# EAGLE design battery_box2 (EAGLE 6.4)
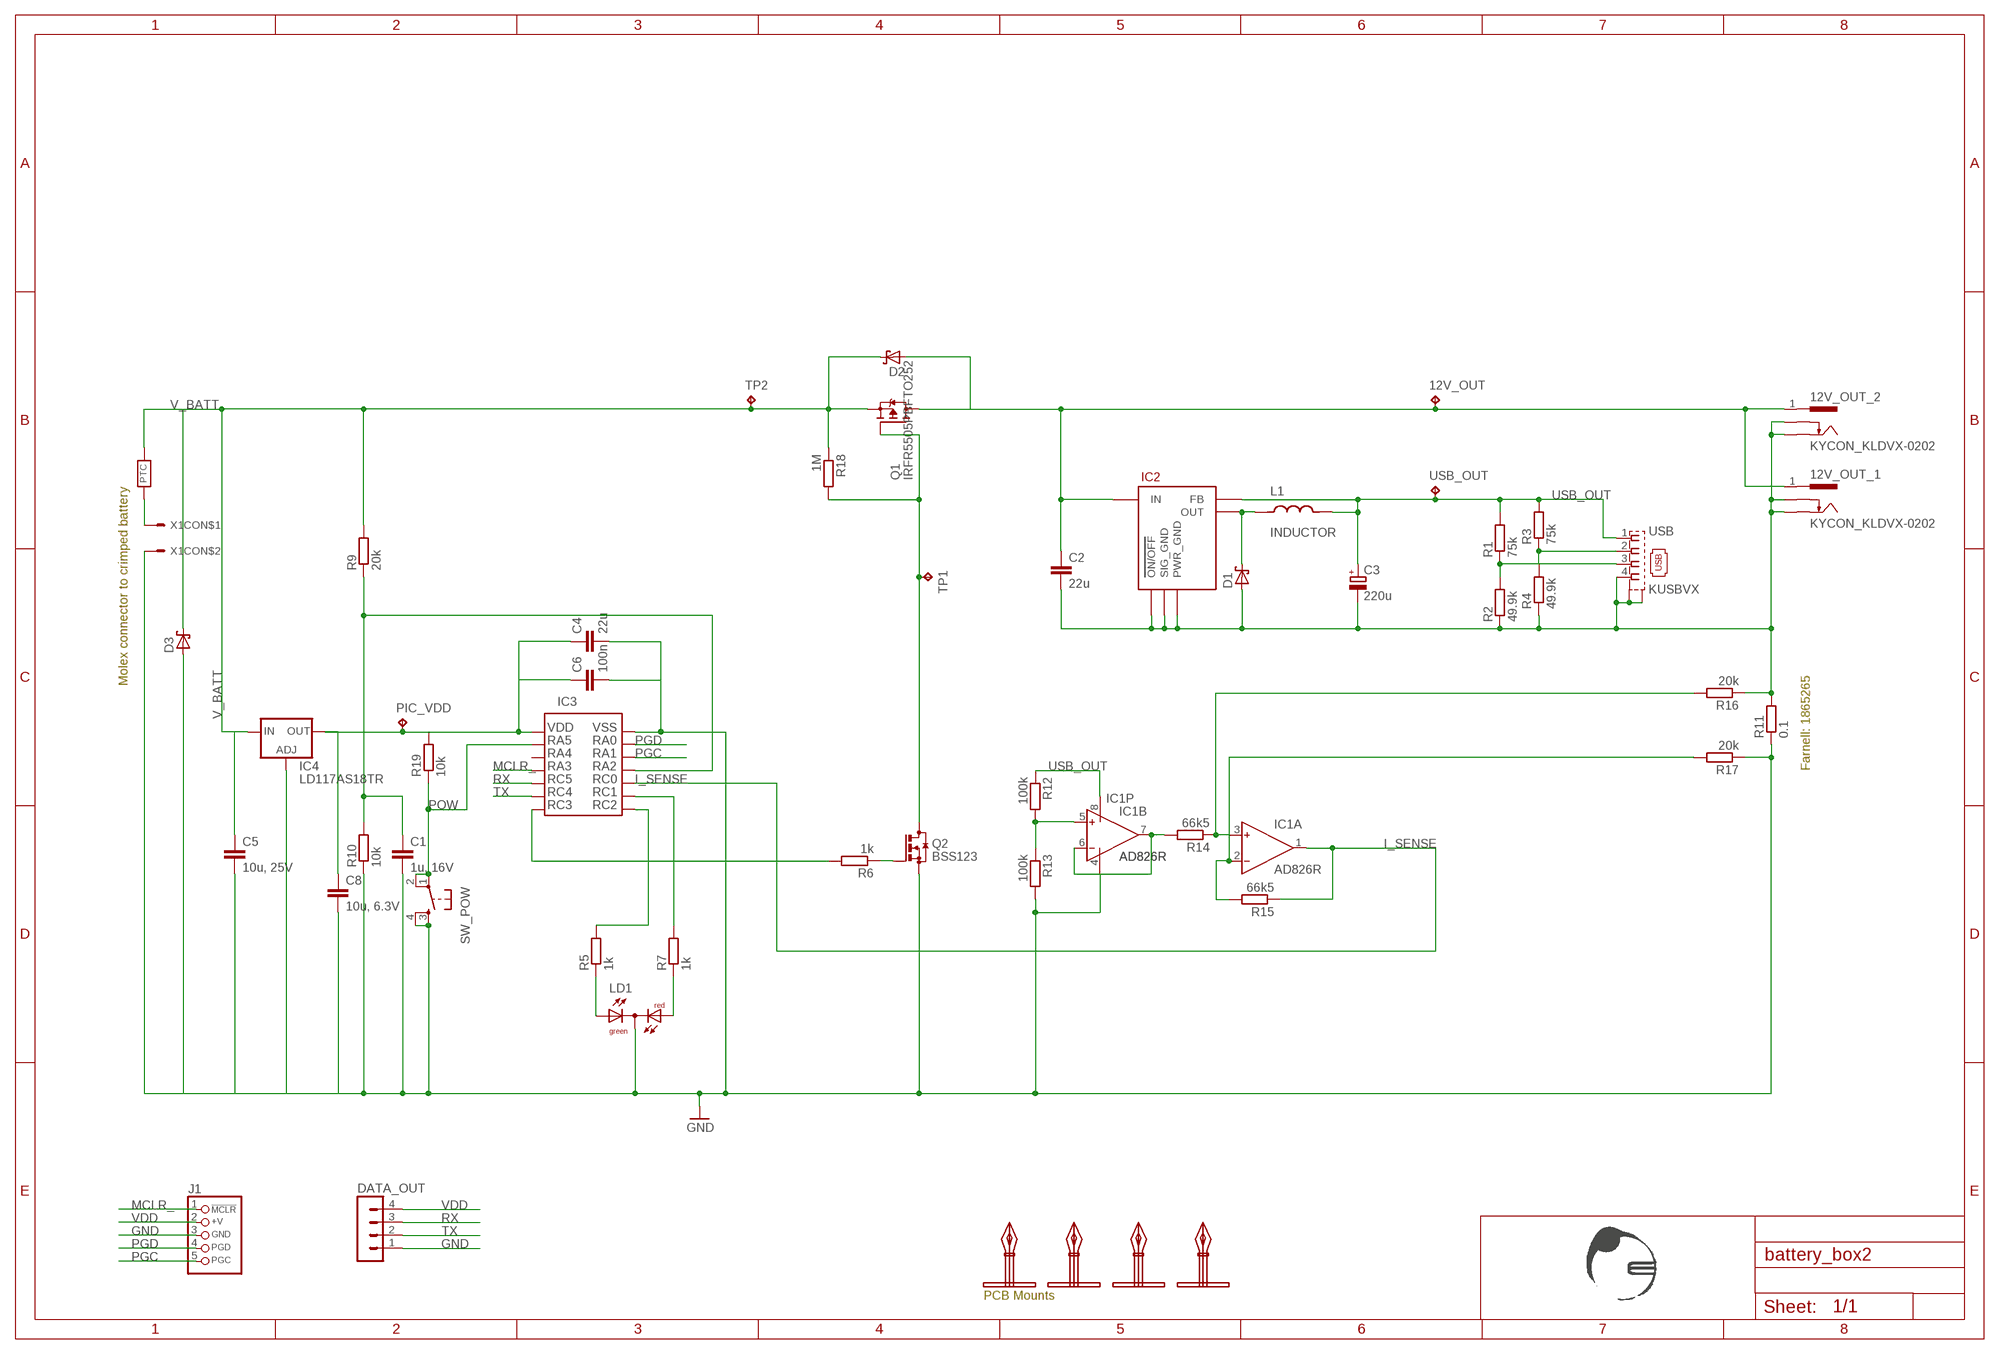
[diagram p0: schematic, sheet 1]

## Parts
12V_OUT  TPTP20R  [TP20R]
12V_OUT_1  KYCON_KLDVX-0202  [KYCON_KLVDX_2020_B]
12V_OUT_2  KYCON_KLDVX-0202  [KYCON_KLVDX_2020_B]
C1  1u, 16V  C-EUC0805  [C0805]
C2  22u  C-EUC1210  [C1210]
C3  220u  CPOL-EUE  [PANASONIC_E]
C4  22u  C-EUC0805  [C0805]
C5  10u, 25V  C-EUC1210  [C1210]
C6  100n  C-EUC0402  [C0402]
C8  10u, 6.3V  C-EUC0805  [C0805]
D1  SCHOTTKY-DIODESMD  [SMB]
D2  SCHOTTKY-DIODESMC  [SMC]
D3  SCHOTTKY-DIODESMC  [SMC]
DATA_OUT  MA04-1  [MA04-1]
IC1  AD826R  [SO8]
IC2  LM2574  [SO14W]
IC3  PIC16F1824  [SO-14]
IC4  LD117AS18TR  [SOT223]
J1  CON_HEADER_PRG_PIC_ICSPA  [HEADER_PRG_1X05]
L1  INDUCTOR  [SMD_INDUCTOR]
LD1  DUOLED-RG-C  [DUOLED-C-5MM]
PIC_VDD  TPTP14R  [TP14R]
Q1  IRFR5505PBFTO252  [TO252]
Q2  BSS123  [SOT23]
R1  75k  R-EU_R0805  [R0805]
R2  49.9k  R-EU_R0805  [R0805]
R3  75k  R-EU_R0805  [R0805]
R4  49.9k  R-EU_R0805  [R0805]
R5  1k  R-EU_R0805  [R0805]
R6  1k  R-EU_R0805  [R0805]
R7  1k  R-EU_R0805  [R0805]
R9  20k  R-EU_R0805  [R0805]
R10  10k  R-EU_R0805  [R0805]
R11  0.1  R-EU_R2512  [R2512]
R12  100k  R-EU_R0805  [R0805]
R13  100k  R-EU_R0805  [R0805]
R14  66k5  R-EU_R0805  [R0805]
R15  66k5  R-EU_R0805  [R0805]
R16  20k  R-EU_R0805  [R0805]
R17  20k  R-EU_R0805  [R0805]
R18  1M  R-EU_R0805  [R0805]
R19  10k  R-EU_R0805  [R0805]
SW_POW  TAC_SWITCHPTH  [TACTILE-PTH]
TP1  TPTP14R  [TP14R]
TP2  TPTP14R  [TP14R]
U$1  EQUINOX_LOGO_SMALL  [EQUINOX_LOGO_SMALL]
U$2  PTC  [MINISMDC260F]
U$5  PCB_MOUNT_RICHO  [PCBMOUNT]
U$6  PCB_MOUNT_RICHO  [PCBMOUNT]
U$7  PCB_MOUNT_RICHO  [PCBMOUNT]
U$8  PCB_MOUNT_RICHO  [PCBMOUNT]
USB  KUSBVX  [KUSBVX]
USB_OUT  TPTP20R  [TP20R]
X1  CON_MOLEX_39_29_1028  [MOLEX_39_29_1028]

## Nets
12V_OUT [power]: 12V_OUT.TP 12V_OUT_1.1(PAD1) 12V_OUT_2.1(PAD1) C2.1 D2.A IC2.10(IN) Q1.3(D)
GND [power]: C1.2 C4.2 C5.2 C6.2 C8.2 D3.A DATA_OUT.1 IC1.4(P:V-) IC3.14 IC4.1(ADJ) J1.3(GND) LD1.C Q2.2(S) R10.1 R11.1 R13.2 R17.1 SW_POW.3 SW_POW.4 X1.P$2
GND_OUTPUT [power]: 12V_OUT_1.2(PAD2) 12V_OUT_1.3(PAD3) 12V_OUT_2.2(PAD2) 12V_OUT_2.3(PAD3) C2.2 C3.- D1.A IC2.4(SIG_GND) IC2.5(ON/OFF) IC2.6(PWR_GND) R2.1 R4.1 R11.2 R16.1 USB.4 USB.M1(S1) USB.M2(S2)
I_SENSE: IC1.1(A:OUT) IC3.10 R15.1
MCLR_: IC3.4 J1.1(/MCLR)
N$2: LD1.AR R7.1
N$3: R1.1 R2.2 USB.3
N$4: LD1.AX(AG) R5.1
N$5: R3.1 R4.2 USB.2
N$6: U$2.P$1 X1.P$1
N$7: IC3.9 R7.2
N$8: C1.1 IC3.11 R9.1 R10.2
N$9: D1.C IC2.12(OUT) L1.P$1
N$10: IC3.8 R5.2
N$11: Q1.1(G) Q2.3(D) R18.2 TP1.TP
N$12: Q2.1(G) R6.1
N$14: IC3.7 R6.2
N$15: IC1.3(A:IN+) R14.1 R16.2
N$16: IC1.2(A:IN-) R15.2 R17.2
N$17: IC1.5(B:IN+) R12.2 R13.1
N$19: IC1.6(B:IN-) IC1.7(B:OUT) R14.2
PGC: IC3.12 J1.5(PGC)
PGD: IC3.13 J1.4(PGD)
POW: IC3.2 R19.1 SW_POW.1 SW_POW.2
RX: DATA_OUT.3 IC3.5
TX: DATA_OUT.2 IC3.6
USB_OUT: C3.+ IC1.8(P:V+) IC2.3(FB) L1.P$2 R1.2 R3.2 R12.1 USB.1 USB_OUT.TP
V_BATT [power]: C5.1 D2.C D3.C IC4.3(IN) Q1.2(S) R9.2 R18.1 TP2.TP U$2.P$2
VDD: C4.1 C6.1 C8.1 DATA_OUT.4 IC3.1 IC4.4(OUT) J1.2(+V) PIC_VDD.TP R19.2
Unconnected: IC3.3

## Notes on the sheet
- Molex connector to crimped battery
- Farnell: 1865265
- PCB Mounts

## Library data of the parts
12V_OUT PIC_VDD TP1 TP2 USB_OUT = testpad:TP: Test pad
12V_OUT_1 12V_OUT_2 = equinox:KYCON_KLDVX-0202
C1 C2 C4-C6 C8 = rcl:C-EU: CAPACITOR, European symbol
C3 = rcl:CPOL-EU: POLARIZED CAPACITOR, European symbol
D1-D3 = diode:SCHOTTKY-DIODE: Schottky Diode
DATA_OUT = con-lstb:MA04-1: PIN HEADER; OC_FARNELL: unknown; OC_NEWARK: unknown
IC1 = analog-devices:AD826: High-Speed, Low-Power Dual Operational Amplifier Source: http://www.analog.com/static/imported-files/data_sheets/AD826.pdf
IC2 = equinox:LM2574
IC3 = equinox:PIC16F1824
IC4 = v-reg:LD117A?*: Low drop fixed and adjustable positive voltage regulators 1 A Source: http://www.st.com/stonline/products/literature/ds/7194/ld1117axx.pdf
J1 = equinox:CON_HEADER_PRG_PIC_ICSP: 5-pin PIC In Circuit Serial Programming header
L1 = equinox:INDUCTOR
LD1 = led:DUOLED-RG-C: DUO LED 2 colors (red/green), 5 mm, round, common Cathode www.ligitek.com or other producers.
Q1 = equinox:IRFR5505PBF
Q2 = transistor-small-signal:BSS123: N-CHANNEL MOS FET
R1-R7 R9-R19 = rcl:R-EU_: RESISTOR, European symbol
SW_POW = SparkFun:TAC_SWITCH: Momentary Switch Button commonly used for reset or general input. Spark Fun Electronics SKU : COM-00097
U$1 = equinox:EQUINOX_LOGO_SMALL
U$2 = equinox:PTC
U$5-U$8 = equinox:PCB_MOUNT_RICHO
USB = con-kycon:KUSBVX: Vertical,Top Entry Universal Serial Bus Connector KUSBVX Series Source: KYCON Sibalco USB vertical socket KUSBV.pdf
X1 = equinox:CON_MOLEX_39_29_1028

## Net classes
0 default: width 0.381 mm, drill 0.61 mm, clearance 0.381 mm
1 power: width 1.016 mm, drill 0.61 mm, clearance 0.381 mm

## Board
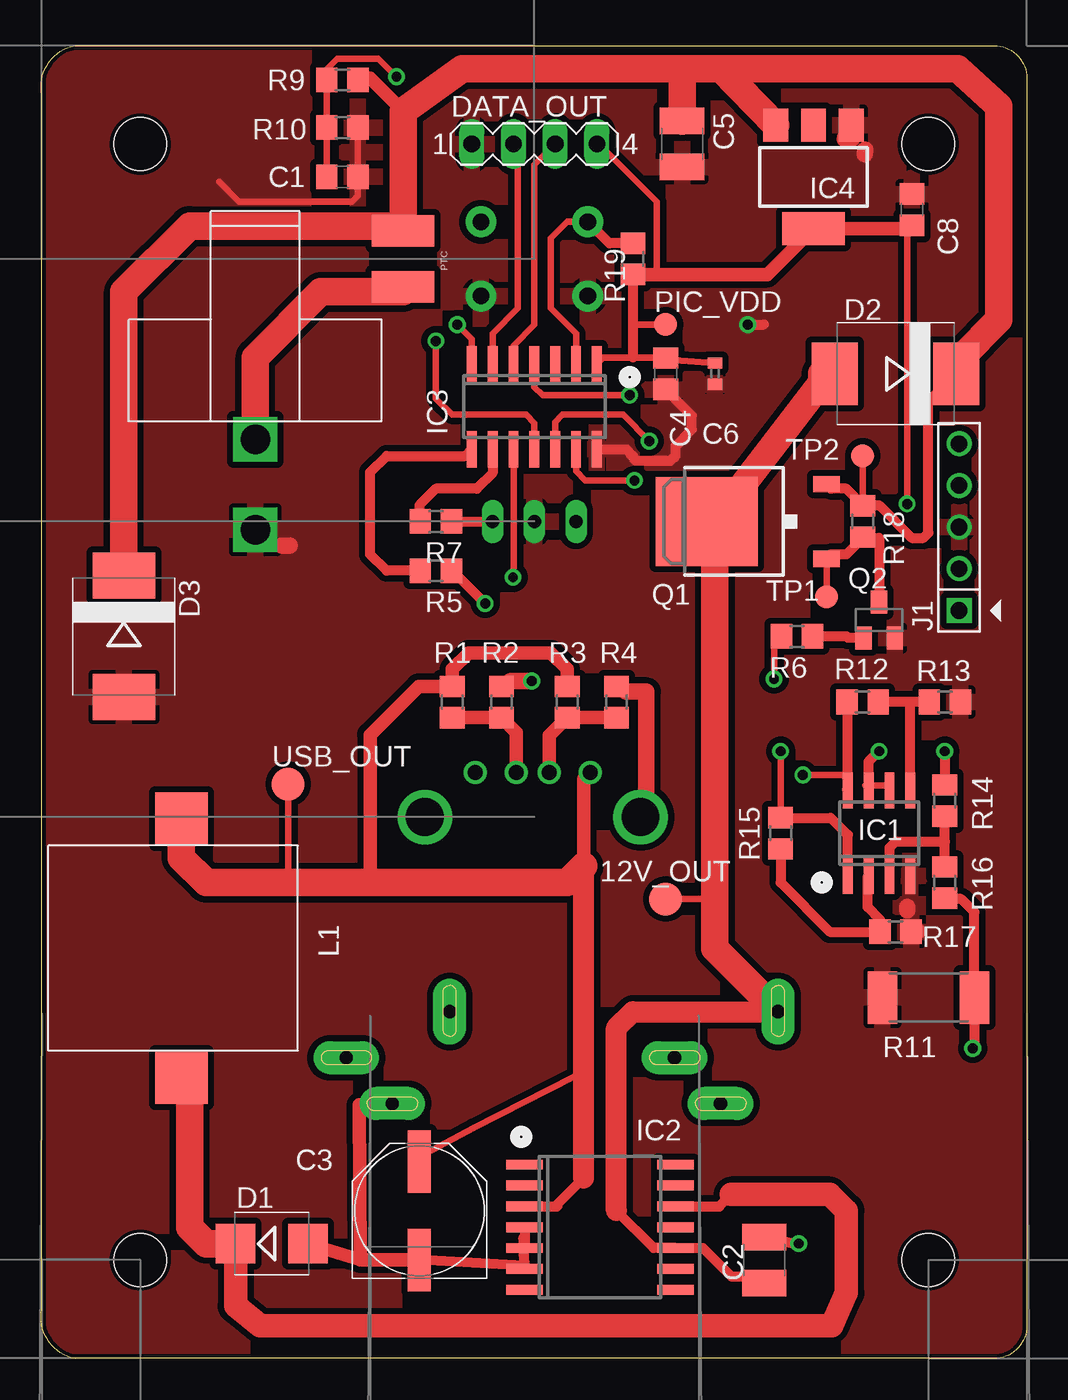
[diagram p1: board, top side]
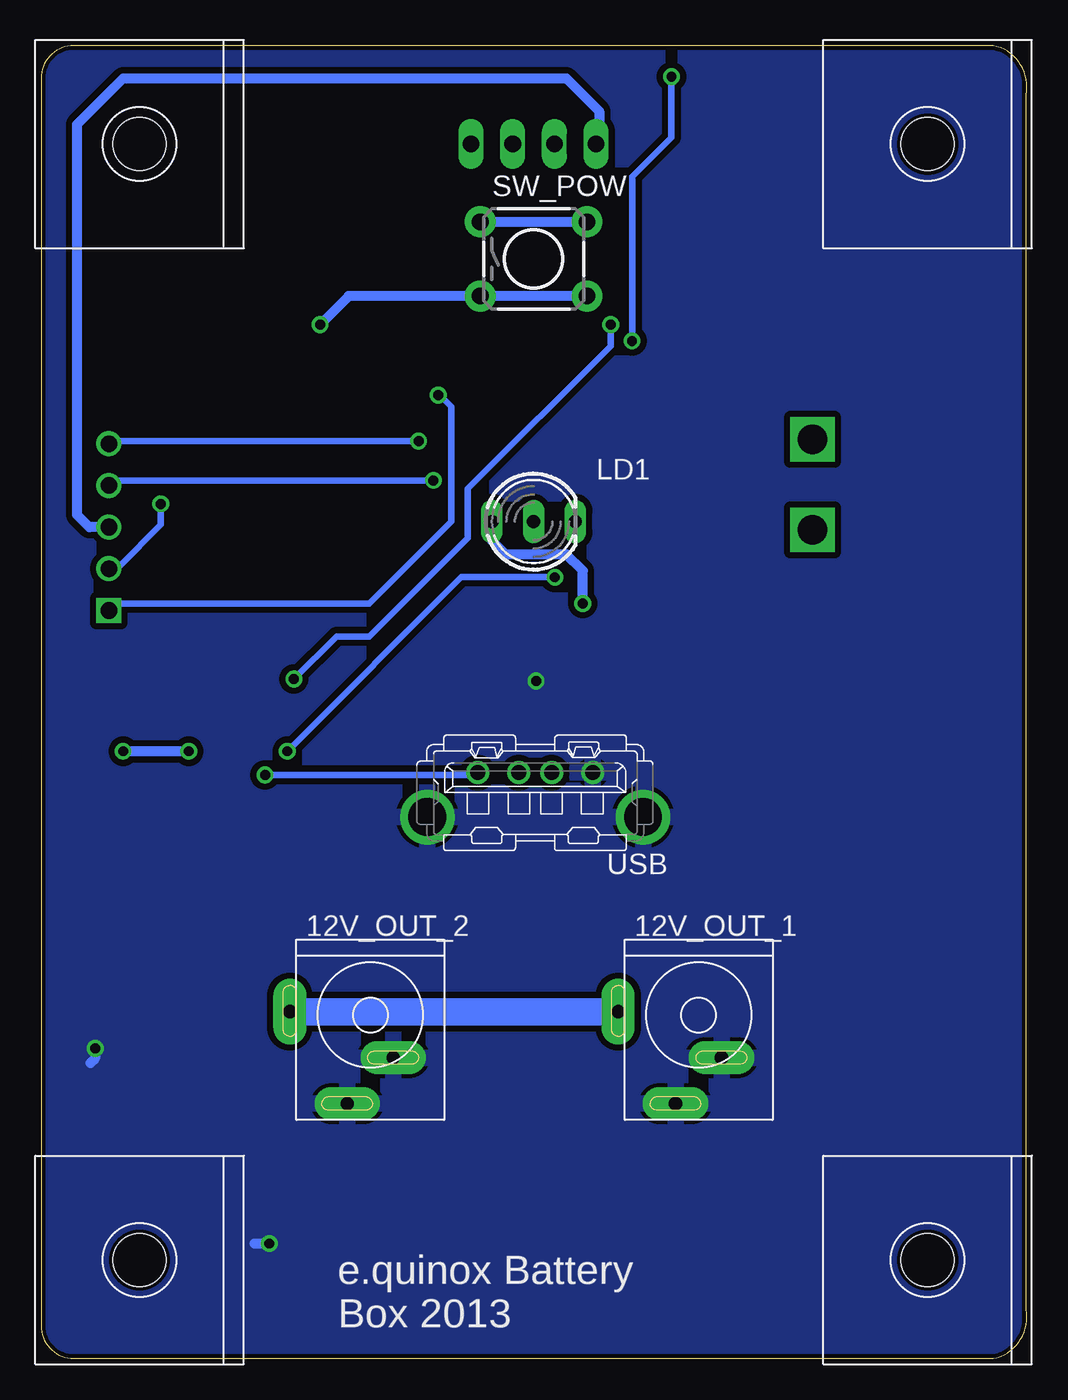
[diagram p2: board, bottom side, seen from below]

Size 60.05 x 80 mm. Coordinates in mm from the lower left corner, seen from the top.
Outline: 0.05,3 0.05,77 arc-90 2.05,80 58.05,80 arc-90 60.05,78 60.05,2 arc-90 58.05,0 2.05,0 arc-90 0.05,3
Copper layers (1*16): Top 0.035mm / dielectric 1.5mm / Bottom 0.035mm
Design rules "Seeed_Studio_Rules_2lyr": minimum track width 6mil, minimum drill 12mil, track to track 6mil, track to pad 6mil, pad to pad 6mil, via to via 6mil, smd to smd 0mil, copper to edge 10mil, drill to drill 10mil, minimum pad ring 10mil, minimum via ring 6mil, stop-mask expansion 2mil, vias tented up to drill 100mil, thermal gap 10mil

### Footprints (pad centres in the part's own frame; a part is rotated, then mirrored left to right if it is on the bottom)
TP20R = smd 2 x 2: TP 0,0
KYCON_KLVDX_2020_B = drill 0.813 pad 2 long: 1 -4.845,0.25; 2 -1.345,-5.35; 3 1.455,-2.55
C0805 = smd 1.3 x 1.5: 1 -0.95,0; 2 0.95,0
C1210 = smd 1.6 x 2.7: 1 -1.4,0; 2 1.4,0
PANASONIC_E = smd 3.8 x 1.4: + 3,0; - -3,0
C0402 = smd 0.7 x 0.9: 1 -0.65,0; 2 0.65,0
SMB = smd 2.4 x 2.4: A 2.2,0; C -2.2,0
SMC = smd 2.8 x 3.8: A 3.7,0; C -3.7,0
MA04-1 = drill 1.016 long: 1 -3.81,0; 2 -1.27,0; 3 1.27,0; 4 3.81,0
SO8 = smd 0.6 x 2.2: 1 -1.905,-2.6; 2 -0.635,-2.6; 3 0.635,-2.6; 4 1.905,-2.6; 5 1.905,2.6; 6 0.635,2.6; 7 -0.635,2.6; 8 -1.905,2.6
SO14W = smd 0.6 x 2.2: 1 -3.81,-4.6; 2 -2.54,-4.6; 3 -1.27,-4.6; 4 0,-4.6; 5 1.27,-4.6; 6 2.54,-4.6; 7 3.81,-4.6; 8 3.81,4.6; 9 2.54,4.6; 10 1.27,4.6; 11 0,4.6; 12 -1.27,4.6; 13 -2.54,4.6; 14 -3.81,4.6
SO-14 = smd 0.6 x 2.2: 1 -3.81,-2.6; 2 -2.54,-2.6; 3 -1.27,-2.6; 4 0,-2.6; 5 1.27,-2.6; 6 2.54,-2.6; 7 3.81,-2.6; 8 3.81,2.6; 9 2.54,2.6; 10 1.27,2.6; 11 0,2.6; 12 -1.27,2.6; 13 -2.54,2.6; 14 -3.81,2.6
SOT223 = smd 1.5 x 2: 1 -2.3,-3.15; 2 0,-3.15; 3 2.3,-3.15 | smd 3.8 x 2: 4 0,3.15
HEADER_PRG_1X05 = drill 1.016 square: 1 -5.08,0 | drill 1.016: 2 -2.54,0; 3 0,0; 4 2.54,0; 5 5.08,0
SMD_INDUCTOR = smd 3.2 x 3.2: P$1 -7.9,-0.5; P$2 7.9,-0.5
DUOLED-C-5MM = drill 0.813 long: AR 2.54,0; AX -2.54,0; C 0,0
TP14R = smd 1.4 x 1.4: TP 0,0
TO252 = smd 1 x 1.6: 1 -2.28,-4.8; 2 2.28,-4.8 | smd 5.4 x 6.2: 3 0,2.5
SOT23 = smd 1 x 1.4: 1 -0.95,-1.1; 2 0.95,-1.1; 3 0,1.1
R0805 = smd 1.3 x 1.5: 1 -0.95,0; 2 0.95,0
R2512 = smd 1.8 x 3.2: 1 -2.8,0; 2 2.8,0
TACTILE-PTH = drill 1.016 pad 1.88: 1 -3.251,2.261; 2 3.251,2.261; 3 -3.251,-2.261; 4 3.251,-2.261
MINISMDC260F = smd 1.93 x 3.81: P$1 1.7,0; P$2 -1.7,0
PCBMOUNT = hole 3.2: 0,0
KUSBVX = drill 0.9 pad 1.3: 1 3.5,0; 2 1,0; 3 -1,0; 4 -3.5,0 | drill 2.3 pad 2.8: M1 -6.57,2.71; M2 6.57,2.71
MOLEX_39_29_1028 = drill 1.8 square: P$1 0,0; P$2 0,5.5

### Placement (x,y rotation side)
12V_OUT  38.05,28 0 top
12V_OUT_1  20.05,20.88 0 bottom
12V_OUT_2  40.05,20.88 0 bottom
C1  18.35,72 0 top
C2  44.05,6 90 top
C3  23.05,9 90 top
C4  38.05,60 270 top
C5  39.05,74 270 top
C6  41.05,60 270 top
C8  53.05,70 90 top
D1  14.05,7 0 top
D2  52.05,60 180 top
D3  5.05,44 270 top
DATA_OUT  30.05,74 0 top
IC1  51.05,32 0 top
IC2  34.05,8 270 top
IC3  30.05,58 180 top
IC4  47.05,72 180 top
J1  55.92,50.66 90 top
L1  8.05,25 90 top
LD1  30.05,51 0 bottom
PIC_VDD  38.05,63 0 top
Q1  43.05,51 90 top
Q2  51.05,45 0 top
R1  25.05,40 90 top
R2  28.05,40 270 top
R3  32.05,40 90 top
R4  35.05,40 270 top
R5  24.05,48 180 top
R6  46.05,44 180 top
R7  24.05,51 180 top
R9  18.35,77.9 0 top
R10  18.35,75 180 top
R11  54.05,22 0 top
R12  50.05,40 0 top
R13  55.05,40 0 top
R14  55.05,34 90 top
R15  45.05,32 270 top
R16  55.05,29 90 top
R17  52.05,26 180 top
R18  50.05,51 270 top
R19  36.05,67 270 top
SW_POW  30.05,67 0 bottom
TP1  47.85,46.4 0 top
TP2  50.05,55 0 top
U$1  47.05,57 0 bottom
U$2  22.05,67 270 top
U$5  54.05,6 0 bottom
U$6  6.05,6 0 bottom
U$7  54.05,74 0 bottom
U$8  6.05,74 0 bottom
USB  29.95,35.7 180 bottom
USB_OUT  15.05,35 0 top
X1  13.05,56 180 top

### Tracks (layer width: path | path; a pad name or v marks a point on that pad's centre or on a via)
12V_OUT
  Top 0.406: 12V_OUT.TP 41.05,28 41.05,24.98
  Top 0.61: D2.A 47.55,60 | 35.05,9 37.32,6.73 IC2.10 40.32,6.73 42.05,5 44,5 C2.1
  Top 1.27: 35.05,9 35.05,20.13 36.05,21.13 12V_OUT_2.1
  Top 1.676: 47.55,60 47.55,59.5 41.05,51 | 41.05,51 Q1.3 40.55,50.5 41.05,51 | 41.05,51 41.05,24.98 12V_OUT_2.1
  Bottom 1.676: 12V_OUT_1.1 12V_OUT_2.1
GND  (via drill 0.6 pad 1.02)
  Top 0.406: R10.1 19.3,70.85 18.95,70.5 12.05,70.5 10.85,71.7
  Top 0.61: v43.05,63 44.05,63 | IC3.14 35.65,55.4 36.05,55 36.05,54.9 36.25,54.7 38.35,54.7 38.65,55 38.65,55.6 39.65,56.6 39.65,57.45 C4.2
  Top 1.016: R17.1 53.39,26.04 53,26.04 | 52.75,27.3 52.75,27.51 | C5.2 38.78,72.39 39.05,72.39 | IC4.1 48.94,74.3 49.35,74.3 | 13.38,50.16 12.75,50.16 X1.P$2 | 14.65,49.53 15.16,49.53 | 50.21,73.66 50.17,73.39
  Bottom 0.61: SW_POW.4 SW_POW.3 41.31,64.74 v43.05,63 | J1.3 57.11,50.66 57.85,51.4 57.85,75.2 55.05,78 28.05,78 26.05,76 26.05,74.19 DATA_OUT.1
  pour Top: 0.05,80 60.05,80 60.05,0 0.05,0
GND_OUTPUT  (via drill 0.6 pad 1.02, 0.61 pad 1.02)
  Top 0.61: IC2.6 29.44,5.66 | 29.44,5.66 29.39,6.3 29.38,7.37 | 29.44,5.66 C3.- | IC2.5 29.38,7.37 | IC2.4 29.45,6.86 29.38,7.37 | C2.2 46.1,6.95 v46.15,7 | R16.1 55.1,28 56.05,28 56.85,27.2 R11.2 56.85,19 v56.75,18.9
  Top 0.813: D1.A 19.45,6 | 19.45,6 C3.- | 12V_OUT_1.2 19.39,15.45 19.45,6
  Top 1.016: v29.89,41.27 28.62,41.27 R2.1 | R4.1 35.61,40.64 36.88,40.64 36.88,33.02 USB.M2
  Bottom 0.61: v46.15,7 47.05,7 | v56.75,18.9 56.75,18.3 57.05,18
  pour Bottom: 0.05,80 60.05,80 60.05,0 0.05,0
I_SENSE  (via drill 0.6 pad 1.02)
  Top 0.406: IC3.10 28.78,48.63 v28.75,47.6 | v45.05,37 R15.1
  Top 0.61: R15.1 48.1,32.95 49.14,31.91 IC1.1
  Bottom 0.406: v28.75,47.6 34.45,47.6 v45.05,37
MCLR_  (via drill 0.6 pad 1.02)
  Top 0.406: IC3.4 30.05,59.2 30.55,58.7 v35.85,58.7
  Bottom 0.406: v35.85,58.7 35.75,58.7 35.05,58 35.05,51 40.05,46 55.5,46 J1.1
N$2
  Top 0.61: R7.1 LD1.AR
N$3
  Top 0.813: R1.1 R2.2 28.95,38.15 USB.3
N$4  (via drill 0.6 pad 1.02)
  Top 0.61: R5.1 25.05,48 v27.05,46
  Bottom 0.61: v27.05,46 27.05,48 28.05,49 31.75,49 32.65,49.9 32.65,50.94 LD1.AX
N$5
  Top 0.813: USB.2 30.95,37.95 R3.1 R4.2
N$6
  Top 1.676: X1.P$1 13.05,61 17.05,65 22.05,65 U$2.P$1
N$7
  Top 0.61: IC3.9 27.51,53.96 26.55,53 24.05,53 23.05,52 23.05,51.05 R7.2
N$8  (via drill 0.6 pad 1.02)
  Top 0.406: C1.1 R10.2 R9.1 17.4,78.55 18.05,79.2 20.55,79.2 v21.65,78.1 | IC3.11 30.05,57 29.55,57.5 25.05,57.5 24.05,58.5 v24.05,62
  Bottom 0.406: v21.65,78.1 21.65,74.4 24.05,72 v24.05,62
N$9
  Top 0.61: IC2.12 41.32,9.27 42.05,10
  Top 1.422: D1.C 11.85,3.2 13.35,2 48.15,2 49.05,4 49.05,9 48.05,10 42.05,10
  Top 1.676: D1.C 10.05,7 9.05,8 9.05,16.6 L1.P$1
N$10
  Top 0.61: R5.2 21.05,48 20.05,49 20.05,54 21.05,55 25.84,55 IC3.8
N$11
  Top 0.406: TP1.TP Q1.1
  Top 0.61: R18.2 50.05,50 | 50.05,50 49.05,49 48.13,49 Q1.1 | 50.05,50 51.05,50 Q2.3
N$12
  Top 0.61: Q2.1 49.15,43.9 49.05,44 R6.1
N$14  (via drill 0.6 pad 1.02)
  Top 0.406: IC3.7 26.24,62.11 v25.35,63 | v44.65,41.4 44.65,43.55 R6.2
  Bottom 0.406: v25.35,63 25.35,61.7 34.05,53 34.05,50 40.05,44 42.05,44 v44.65,41.4
N$15
  Top 0.61: R16.2 55.05,31.5 | 55.05,31.5 R14.1 | IC1.3 51.68,31.14 52.05,31.5 55.05,31.5
N$16
  Top 0.61: IC1.2 50.35,29.34 50.35,27.5 51.1,26.75 R17.2 48.05,26 45.05,29 R15.2
N$17
  Top 0.61: R13.1 53.05,40 | 53.05,40 R12.2 | IC1.5 52.95,39.91 53.05,40
N$19  (via drill 0.6 pad 1.02)
  Top 0.381: IC1.6 51.48,34.92 50.21,34.92 IC1.7
  Top 0.61: IC1.7 50.41,36.37 v51.05,37 | v55.05,37 R14.2
  Bottom 0.61: v51.05,37 v55.05,37
PGC  (via drill 0.6 pad 1.02)
  Top 0.406: IC3.12 31.32,57.07 31.75,57.5 35.45,57.5 v37.05,55.9
  Bottom 0.406: v37.05,55.9 55.76,55.9 J1.5
PGD  (via drill 0.6 pad 1.02)
  Top 0.406: IC3.13 32.59,54.06 33.15,53.5 v36.15,53.5
  Bottom 0.406: v36.15,53.5 55.62,53.5 J1.4
POW
  Top 0.406: IC3.2 32.59,62.46 31.05,64 31.05,68.26 32.05,69.26 SW_POW.1
  Top 0.61: R19.1 34.61,67.95 SW_POW.1
  Bottom 0.61: SW_POW.1 SW_POW.2
RX
  Top 0.406: IC3.5 28.78,61.73 30.05,63 30.05,72.73 DATA_OUT.3
TX
  Top 0.406: IC3.6 27.51,62.46 29.05,64 29.05,73.73 DATA_OUT.2
USB_OUT  (via drill 0.61 pad 1.02)
  Top 0.381: C3.+ 23.18,12.26 23.35,12.43 26.35,14.06 32.43,17.14 33.05,17.14 | v46.4,35.56 48.94,35.56 IC1.8
  Top 0.406: USB_OUT.TP 15.05,29
  Top 0.61: IC2.3 31.42,9.27 31.45,9.3 31.45,9.4 33.05,11 | R12.1 49.1,34.65 IC1.8
  Top 0.813: 33.05,30 33.05,35.3 USB.1 | 20.05,29 20.05,38 23,40.95 R1.2 25.05,42 26.05,43 31.05,43 32.05,42 R3.2
  Top 1.27: 33.05,11 33.05,17.14 33.05,30
  Top 1.676: L1.P$2 8.55,30.5 10.05,29 15.05,29 20.05,29 32.05,29 33.05,30
  Bottom 0.381: v46.4,35.56 33.7,35.56 USB.1
V_BATT
  Top 0.406: TP2.TP R18.1
  Top 0.61: Q1.2 48.13,53 49.05,53 50.05,52 R18.1 50.1,52 51.05,52 53.05,50 53.75,50 54.05,50.3 54.05,58.3 D2.C
  Top 0.813: R9.2 20.05,78 22.05,76
  Top 1.016: D2.C 55.93,60.33 56.05,61
  Top 1.676: 22.05,69 22.05,76 25.65,78.6 39.05,78.6 | 39.05,78.6 41.4,78.6 | 41.4,78.6 41.37,78.53 41.75,78.6 55.85,78.6 58.35,76.3 58.35,63.3 56.05,61 56.05,60 | 41.4,78.6 IC4.3 | C5.1 39.05,78.6 | D3.C 5.05,65 9.05,69 22.05,69 | 22.05,69 U$2.P$2
VDD  (via drill 0.61 pad 1.02)
  Top 0.381: 37.51,66.04 37.51,66.05 37.51,70.48 34.34,73.66 DATA_OUT.4 | v52.75,52.07 52.75,68.58 C8.1
  Top 0.406: IC3.1 34.26,61 36.05,61 38.05,61 C4.1 38.15,60.85 C6.1 | PIC_VDD.TP 36.05,63
  Top 0.61: R19.2 36.05,63 36.05,61
  Top 0.813: R19.2 37.51,66.05 44.25,66.05 IC4.4 52.85,68.85 C8.1
  Bottom 0.381: v52.75,52.07 52.75,50.8 55.29,48.26 J1.2

### Text on the board
bNames: e.quinox Battery / Box 2013